# EAGLE design M116X (EAGLE 6.6.0)
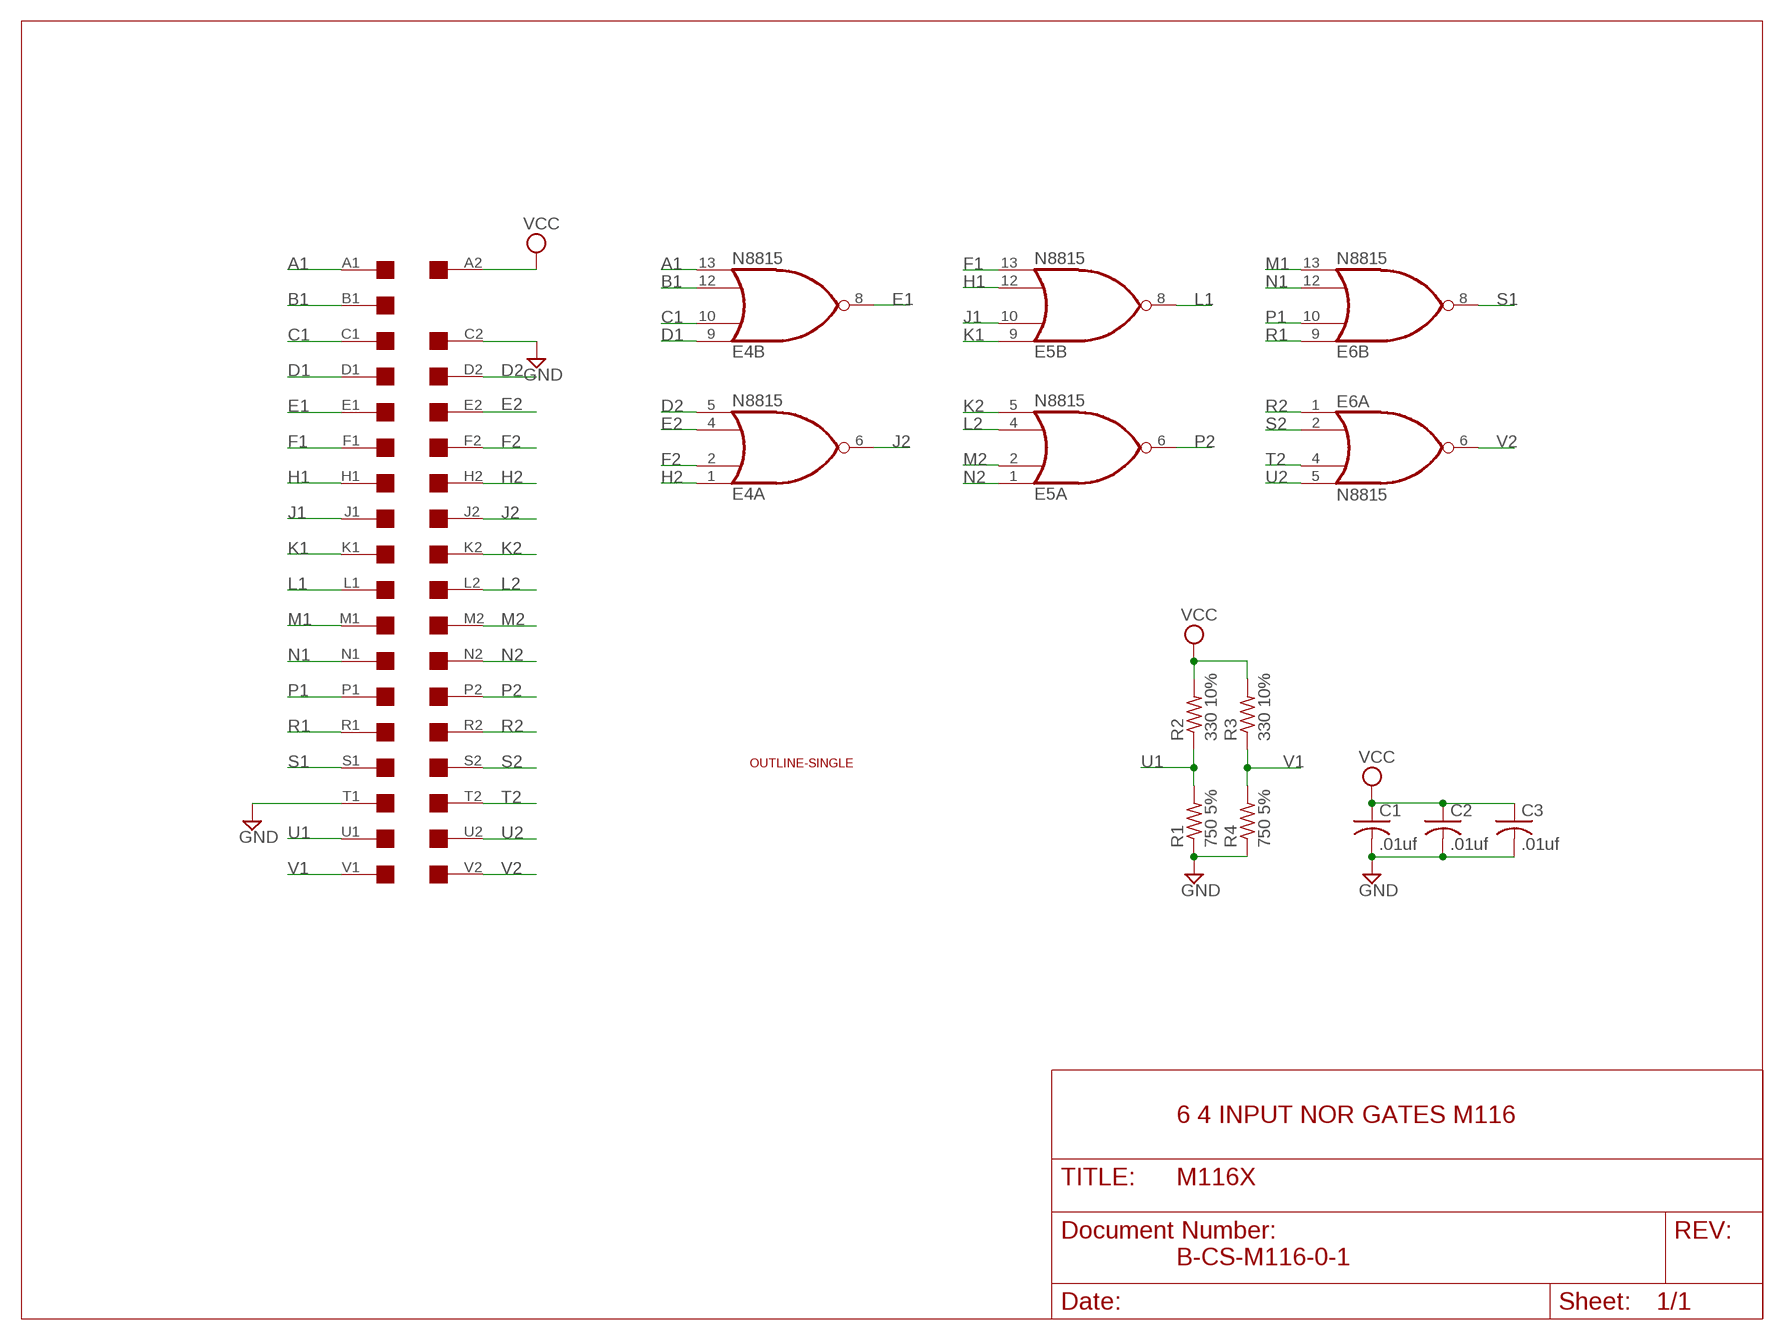
[diagram p0: schematic, sheet 1]

## Parts
C1  .01uf  C-US050-025X075  [C050-025X075]
C2  .01uf  C-US050-025X075  [C050-025X075]
C3  .01uf  C-US050-025X075  [C050-025X075]
E4  N8815  [DIL14]
E5  N8815  [DIL14]
E6  N8815  [DIL14]
R1  750 5%  R-US_0207/10  [0207/10]
R2  330 10%  R-US_0207/10  [0207/10]
R3  330 10%  R-US_0207/10  [0207/10]
R4  750 5%  R-US_0207/10  [0207/10]
U$1  SINGLE  [EDGE-CON2]
U$4  OUTLINE-SINGLE  [SINGLE]

## Nets
A1: E4.13(B:I3) U$1.A1
B1: E4.12(B:I2) U$1.B1
C1: E4.10(B:I1) U$1.C1
D1: E4.9(B:I0) U$1.D1
D2: E4.5(A:I3) U$1.D2
E1: E4.8(B:O) U$1.E1
E2: E4.4(A:I2) U$1.E2
F1: E5.13(B:I3) U$1.F1
F2: E4.2(A:I1) U$1.F2
GND [Supply]: C1.2 C2.2 C3.2 R1.1 R4.1 U$1.C2 U$1.T1
H1: E5.12(B:I2) U$1.H1
H2: E4.1(A:I0) U$1.H2
J1: E5.10(B:I1) U$1.J1
J2: E4.6(A:O) U$1.J2
K1: E5.9(B:I0) U$1.K1
K2: E5.5(A:I3) U$1.K2
L1: E5.8(B:O) U$1.L1
L2: E5.4(A:I2) U$1.L2
M1: E6.13(B:I3) U$1.M1
M2: E5.2(A:I1) U$1.M2
N1: E6.12(B:I2) U$1.N1
N2: E5.1(A:I0) U$1.N2
P1: E6.10(B:I1) U$1.P1
P2: E5.6(A:O) U$1.P2
R1: E6.9(B:I0) U$1.R1
R2: E6.1(A:I0) U$1.R2
S1: E6.8(B:O) U$1.S1
S2: E6.2(A:I1) U$1.S2
T2: E6.4(A:I2) U$1.T2
U1: R1.2 R2.1 U$1.U1
U2: E6.5(A:I3) U$1.U2
V1: R3.1 R4.2 U$1.V1
V2: E6.6(A:O) U$1.V2
VCC [Supply]: C1.1 C2.1 C3.1 R2.2 R3.2 U$1.A2
Unconnected: U$1.B2

## Notes on the sheet
- 6 4 INPUT NOR GATES M116
- B-CS-M116-0-1

## Power pins joined to a net without a drawn wire
GND: E4.7(P:GND) E5.7(P:GND) E6.7(P:GND)
VCC: E4.14(P:VCC) E5.14(P:VCC) E6.14(P:VCC)

## Library data of the parts
C1-C3 = rcl:C-US: CAPACITOR, American symbol
E4-E6 = dec-con:N8815: Dual 4 Input NOR Gate
R1-R4 = rcl:R-US_: RESISTOR, American symbol
U$1 = dec-con:SINGLE: Single-Height DEC board
U$4 = dec-con:OUTLINE-*: Board outlines for DEC boards.

## Net classes
1 Supply: width 0.813 mm

## Board
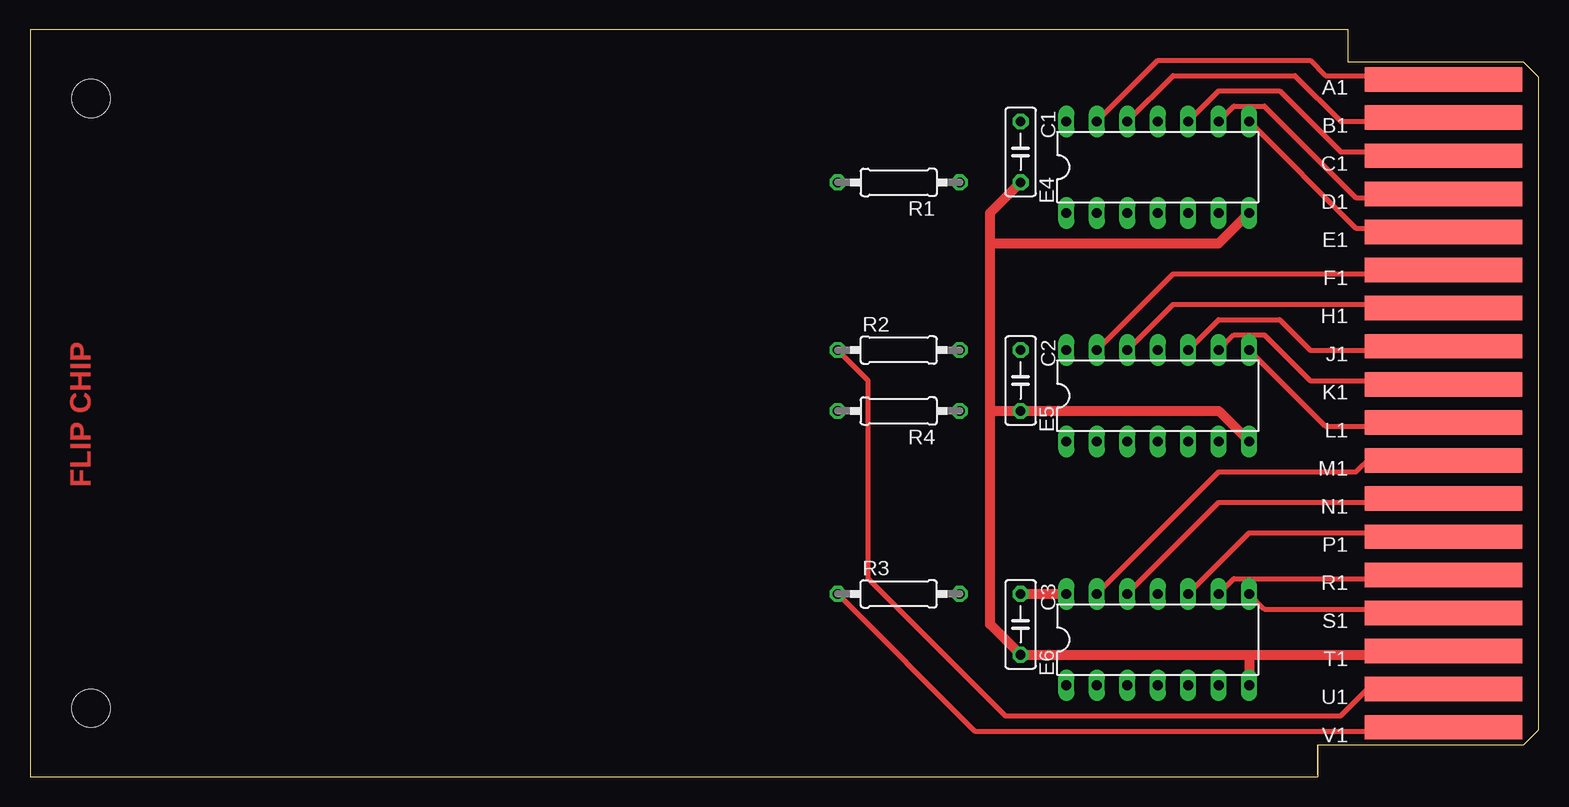
[diagram p1: board, top side]
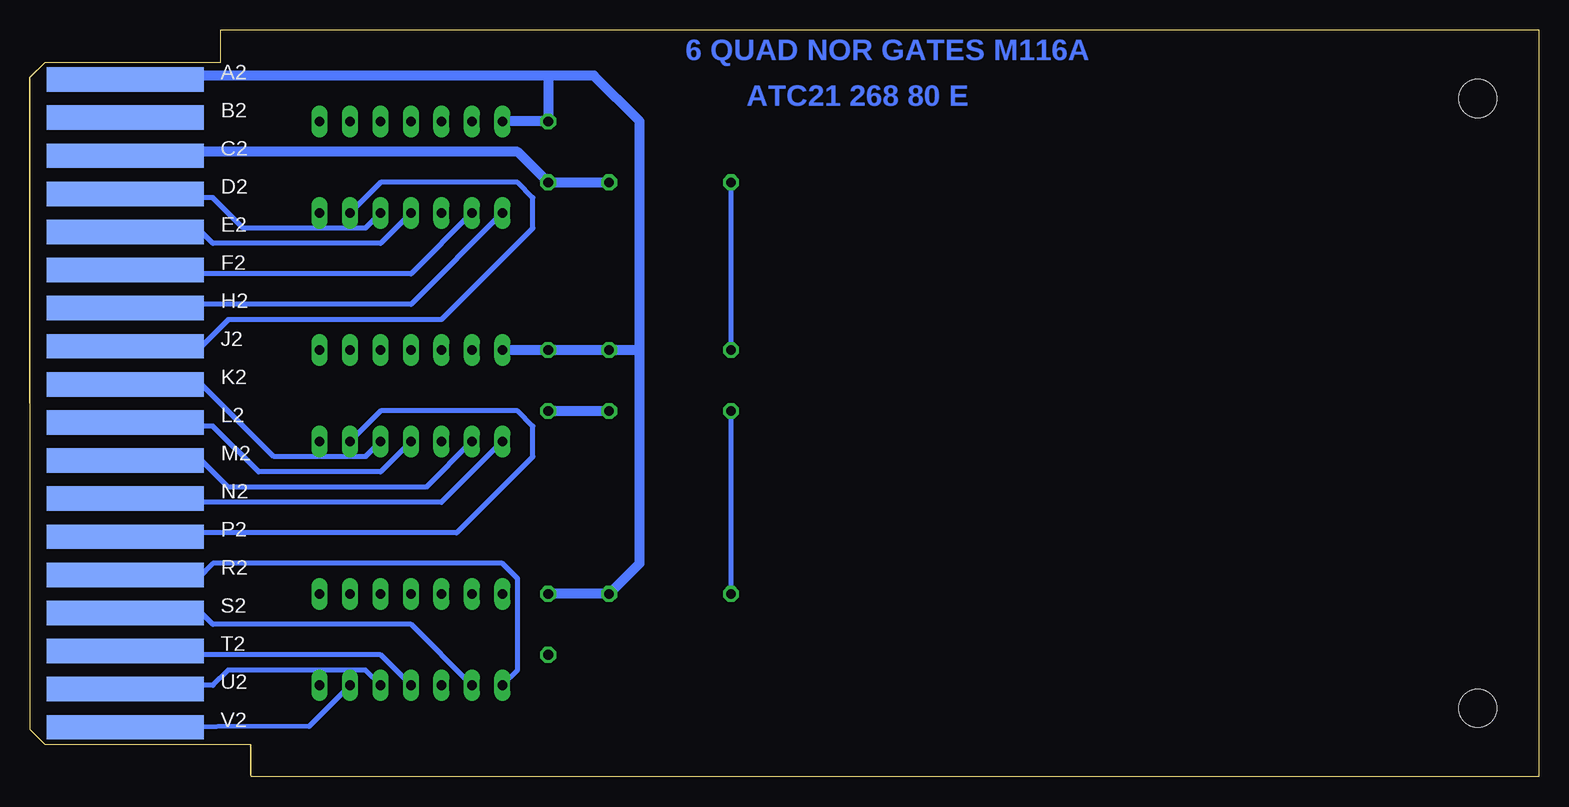
[diagram p2: board, bottom side, seen from below]

Size 125.73 x 62.23 mm. Coordinates in mm from the lower left corner, seen from the top.
Copper layers (1+16): Top 0.035mm / dielectric 1.5mm / Bottom 0.035mm
Design rules "16mils": minimum track width 16mil, minimum drill 32mil, track to track 15mil, track to pad 10mil, pad to pad 10mil, via to via 10mil, smd to smd 10mil, copper to edge 13mil, drill to drill 10mil, minimum pad ring 10mil, minimum via ring 8mil, stop-mask expansion 0mil, vias tented up to drill 0mil, thermal gap 10mil

### Footprints (pad centres in the part's own frame; a part is rotated, then mirrored left to right if it is on the bottom)
C050-025X075 = drill 0.813 octagon: 1 -2.54,0; 2 2.54,0
DIL14 = drill 0.813 long: 1 -7.62,-3.81; 2 -5.08,-3.81; 3 -2.54,-3.81; 4 0,-3.81; 5 2.54,-3.81; 6 5.08,-3.81; 7 7.62,-3.81; 8 7.62,3.81; 9 5.08,3.81; 10 2.54,3.81; 11 0,3.81; 12 -2.54,3.81; 13 -5.08,3.81; 14 -7.62,3.81
0207/10 = drill 0.813 octagon: 1 -5.08,0; 2 5.08,0
EDGE-CON2 = smd 13.106 x 2.032: A1 7.938,4.128; B1 7.938,7.303; C1 7.938,10.477; D1 7.938,13.652; E1 7.938,16.828; F1 7.938,20.003; H1 7.938,23.177; J1 7.938,26.352; K1 7.938,29.527; L1 7.938,32.703; M1 7.938,35.877; N1 7.938,39.053; P1 7.938,42.227; R1 7.938,45.403; S1 7.938,48.578; T1 7.938,51.752; U1 7.938,54.928; V1 7.938,58.102 | smd 13.106 x 2.032 bottom: A2 7.938,4.128; B2 7.938,7.303; C2 7.938,10.477; D2 7.938,13.652; E2 7.938,16.828; F2 7.938,20.003; H2 7.938,23.177; J2 7.938,26.352; K2 7.938,29.527; L2 7.938,32.703; M2 7.938,35.877; N2 7.938,39.053; P2 7.938,42.227; R2 7.938,45.403; S2 7.938,48.578; T2 7.938,51.752; U2 7.938,54.928; V2 7.938,58.102
SINGLE = hole 3.175: 120.65,56.515; 120.65,5.715

### Placement (x,y rotation side)
C1  82.55,52.07 270 top
C2  82.55,33.02 270 top
C3  82.55,12.7 270 top
E4  93.98,50.8 0 top
E5  93.98,31.75 0 top
E6  93.98,11.43 0 top
R1  72.39,49.53 180 top
R2  72.39,35.56 0 top
R3  72.39,15.24 0 top
R4  72.39,30.48 180 top
U$1  125.73,62.23 180 top
U$4  125.73,62.23 180 top

### Tracks (layer width: path | path; a pad name or v marks a point on that pad's centre or on a via)
A1
  Top 0.406: U$1.A1 117.24,58.02 116.84,58.42 107.95,58.42 106.68,59.69 93.98,59.69 E4.13
B1
  Top 0.406: U$1.B1 117.13,54.9 116.84,54.61 109.22,54.61 105.41,58.42 95.25,58.42 E4.12
C1
  Top 0.406: U$1.C1 117.17,51.74 116.84,52.07 109.22,52.07 104.14,57.15 99.06,57.15 E4.10
D1
  Top 0.406: U$1.D1 117.14,48.56 116.84,48.26 110.49,48.26 102.87,55.88 100.33,55.88 E4.9
D2
  Bottom 0.406: U$1.D2 117.14,48.56 116.84,48.26 110.49,48.26 107.95,45.72 97.79,45.72 E4.5
E1
  Top 0.406: U$1.E1 117.17,45.39 116.84,45.72 110.49,45.72 E4.8
E2
  Bottom 0.406: U$1.E2 117.17,45.39 116.84,45.72 111.76,45.72 110.49,44.45 96.52,44.45 E4.4
F1
  Top 0.406: U$1.F1 115.85,42.19 115.57,41.91 95.25,41.91 E5.13
F2
  Bottom 0.406: U$1.F2 117.12,42.19 116.84,41.91 93.98,41.91 E4.2
GND
  Top 0.813: U$1.T1 116.84,10.16 101.6,10.16 | 101.6,10.16 C3.2 80.01,12.7 80.01,30.48 | 101.6,10.16 E6.7 | 80.01,30.48 80.01,44.45 | 80.01,44.45 80.01,46.99 C1.2 | E5.7 99.06,30.48 C2.2 80.01,30.48 | E4.7 99.06,44.45 80.01,44.45
  Bottom 0.813: R1.1 C1.2 85.09,52.07 116.84,52.07 117.17,51.74 U$1.C2 | C2.2 R4.1
H1
  Top 0.406: U$1.H1 117.17,39.04 116.84,39.37 95.25,39.37 E5.12
H2
  Bottom 0.406: U$1.H2 117.17,39.04 116.84,39.37 93.98,39.37 E4.1
J1
  Top 0.406: U$1.J1 117.17,35.89 116.84,35.56 106.68,35.56 104.14,38.1 99.06,38.1 E5.10
J2
  Bottom 0.406: U$1.J2 117.17,35.89 116.84,35.56 111.76,35.56 109.22,38.1 91.44,38.1 83.82,45.72 83.82,48.26 85.09,49.53 96.52,49.53 E4.6
K1
  Top 0.406: U$1.K1 117.14,32.72 116.84,33.02 106.68,33.02 102.87,36.83 100.33,36.83 E5.9
K2
  Bottom 0.406: U$1.K2 117.14,32.72 116.84,33.02 111.76,33.02 105.41,26.67 97.79,26.67 E5.5
L1
  Top 0.406: U$1.L1 117.17,29.54 116.84,29.21 107.95,29.21 E5.8
L2
  Bottom 0.406: U$1.L2 117.17,29.54 116.84,29.21 110.49,29.21 106.68,25.4 96.52,25.4 E5.4
M1
  Top 0.406: U$1.M1 117.17,26.34 116.84,26.67 111.76,26.67 110.49,25.4 99.06,25.4 E6.13
M2
  Bottom 0.406: U$1.M2 117.17,26.34 116.84,26.67 111.76,26.67 109.22,24.13 92.71,24.13 E5.2
N1
  Top 0.406: U$1.N1 117.17,23.19 116.84,22.86 99.06,22.86 E6.12
N2
  Bottom 0.406: U$1.N2 117.17,23.19 116.84,22.86 91.44,22.86 E5.1
P1
  Top 0.406: U$1.P1 115.9,19.99 115.57,20.32 101.6,20.32 E6.10
P2
  Bottom 0.406: U$1.P2 117.17,19.99 116.84,20.32 90.17,20.32 83.82,26.67 83.82,29.21 85.09,30.48 96.52,30.48 E5.6
R1
  Top 0.406: U$1.R1 117.17,16.84 116.84,16.51 100.33,16.51 E6.9
R2
  Bottom 0.406: U$1.R2 117.17,16.84 116.84,16.51 111.76,16.51 110.49,17.78 86.36,17.78 85.09,16.51 85.09,8.89 E6.1
S1
  Top 0.406: U$1.S1 117.14,13.66 116.84,13.97 102.87,13.97 E6.8
S2
  Bottom 0.406: U$1.S2 117.14,13.66 116.84,13.97 111.76,13.97 110.49,12.7 93.98,12.7 E6.2
T2
  Bottom 0.406: U$1.T2 117.17,10.49 116.84,10.16 96.52,10.16 E6.4
U1
  Top 0.406: U$1.U1 115.93,7.26 115.57,7.62 111.76,7.62 109.22,5.08 81.28,5.08 69.85,16.51 69.85,33.02 R2.1
  Bottom 0.406: R2.1 R1.2
U2
  Bottom 0.406: U$1.U2 117.2,7.26 116.84,7.62 110.49,7.62 109.22,8.89 97.79,8.89 E6.5
V1
  Top 0.406: U$1.V1 114.69,4.2 114.3,3.81 78.74,3.81 R3.1
  Bottom 0.406: R3.1 R4.2
V2
  Bottom 0.406: U$1.V2 102.48,4.2 E6.6
VCC
  Top 0.813: C3.1 E6.14
  Bottom 0.813: U$1.A2 117.24,58.02 116.84,58.42 82.55,58.42 | 82.55,58.42 78.74,58.42 74.93,54.61 74.93,35.56 | 74.93,35.56 74.93,17.78 R3.2 C3.1 | 74.93,35.56 R2.2 C2.1 E5.14 | E4.14 C1.1 82.55,58.42

### Text on the board
Top: FLIP CHIP
Bottom: 6 QUAD NOR GATES M116A | ATC21 268 80 E